# EAGLE schematic Final_schema (EAGLE 8.6.2)
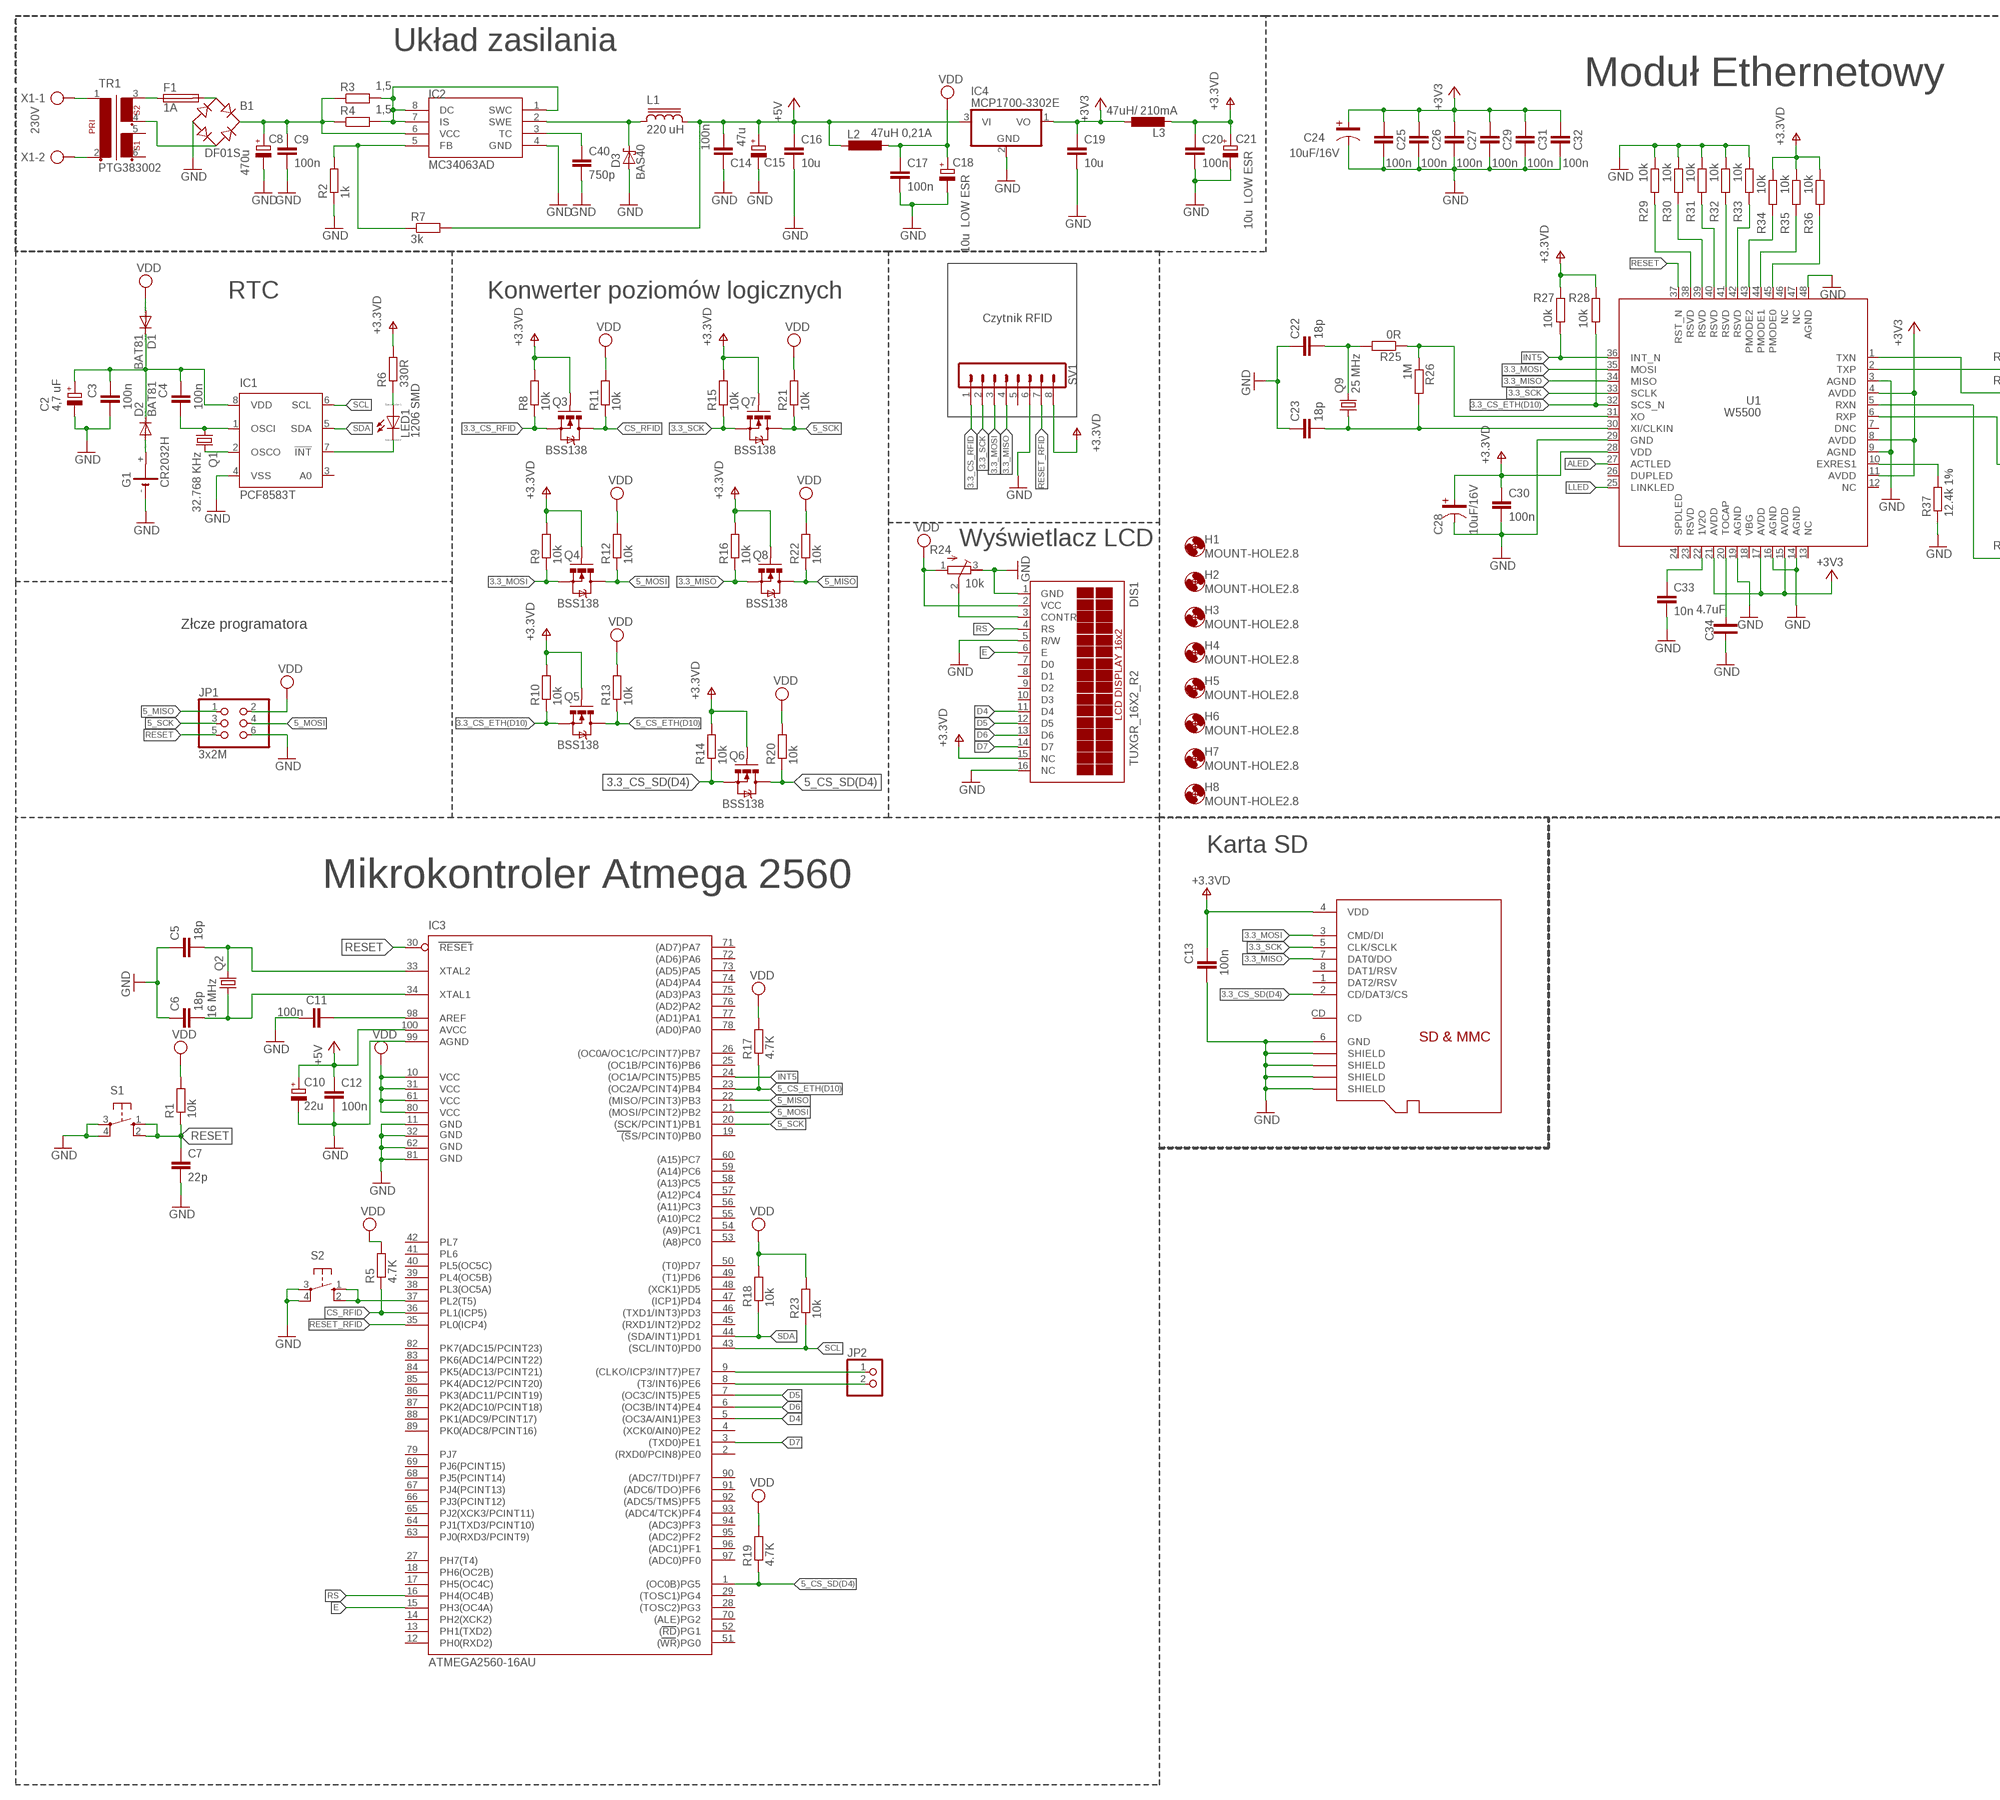
[diagram p0: schematic, sheet 1, part 1 of 2]
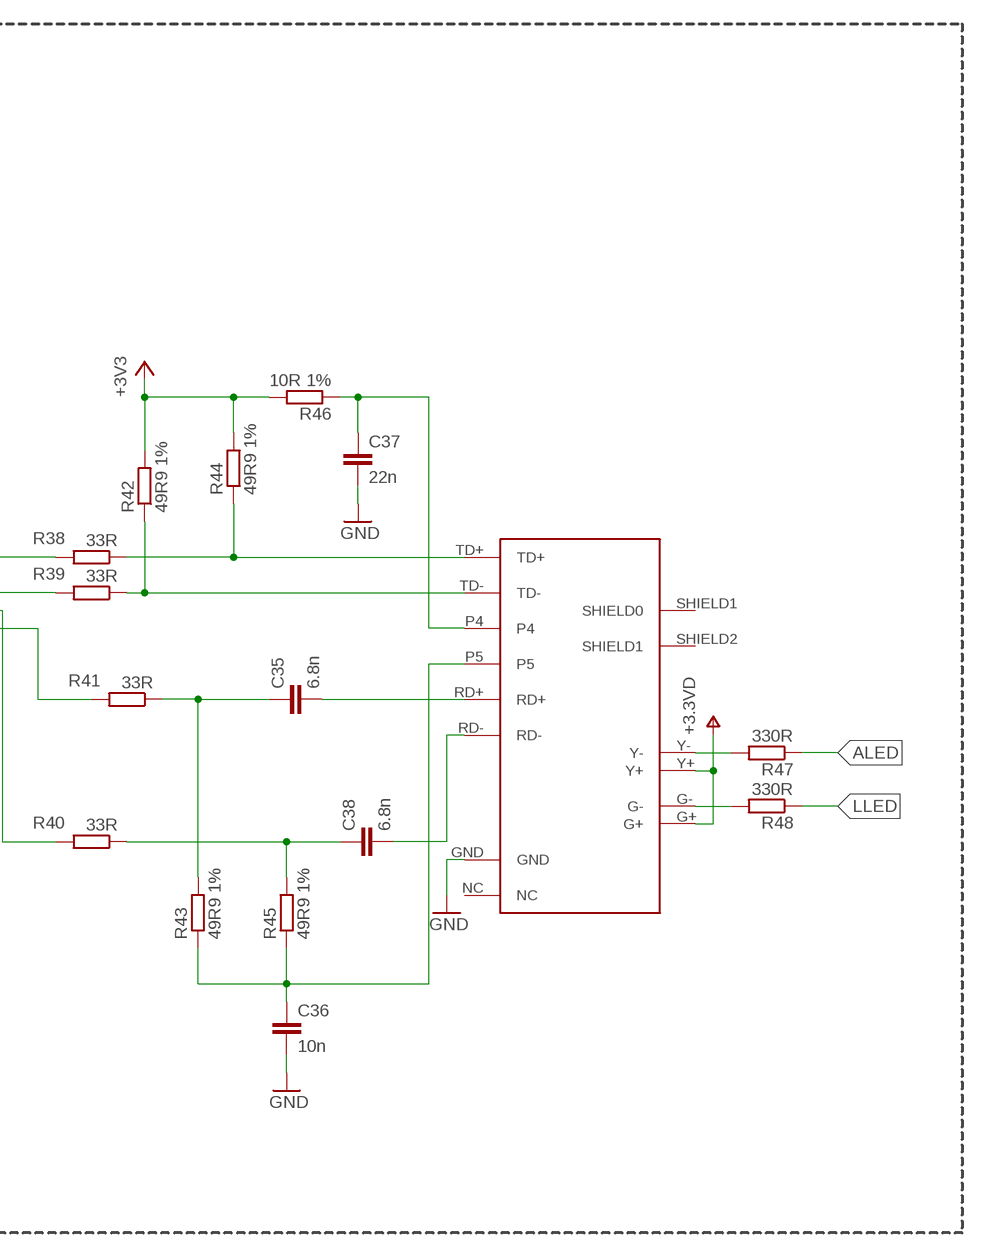
[diagram p1: schematic, sheet 1, part 2 of 2]

## Parts
B1  DF01S  DBDB101G  [DB]
C2  4,7 uF  CPOL-EUUD-5X5,8  [UD-5X5,8_NICHICON]
C3  100n  C-EUC0603  [C0603]
C4  100n  C-EUC0603  [C0603]
C5  18p  C-EUC0603  [C0603]
C6  18p  C-EUC0603  [C0603]
C7  22p  C-EUC0603  [C0603]
C8  470u  CPOL-EUE7.5-16  [E7,5-16]
C9  100n  C-EUC0603  [C0603]
C10  22u  CPOL-EUUD-5X5,8  [UD-5X5,8_NICHICON]
C11  100n  C-EU0603-RND  [C0603-ROUND]
C12  100n  C-EUC0603  [C0603]
C13  100n  C-EUC0603  [C0603]
C14  100n  C-EUC0603  [C0603]
C15  47u  CPOL-EU153CLV-0505  [153CLV-0505]
C16  10u  C-EUC0603  [C0603]
C17  100n  C-EUC0603K  [C0603K]
C18  10u LOW ESR  CPOL-EUE5-10.5  [E5-10,5]
C19  10u  C-EUC0603  [C0603]
C20  100n  C-EUC0603K  [C0603K]
C21  10u LOW ESR  CPOL-EUE5-10.5  [E5-10,5]
C22  18p  C-EUC0603  [C0603]
C23  18p  C-EUC0603  [C0603]
C24  10uF/16V  C-3216(TANTAL)  [C-3216(TANTAL)]
C25  100n  C-EUC0603  [C0603]
C26  100n  C-EUC0603  [C0603]
C27  100n  C-EUC0603  [C0603]
C28  10uF/16V  C-3216(TANTAL)  [C-3216(TANTAL)]
C29  100n  C-EUC0603  [C0603]
C30  100n  C-EUC0603K  [C0603K]
C31  100n  C-EUC0603  [C0603]
C32  100n  C-EUC0603  [C0603]
C33  10n  C-EUC0603  [C0603]
C34  4.7uF  C-2012  [C-2012]
C35  6.8n  C-EUC0603  [C0603]
C36  10n  C-EUC0603  [C0603]
C37  22n  C-EUC0603  [C0603]
C38  6.8n  C-EUC0603  [C0603]
C40  750p  C-EUC0603K  [C0603K]
D1  BAT81  [DO34-7]
D2  BAT81  [DO34-7]
D3  BAS40  [SOT23]
DIS1  TUXGR_16X2_R2  [TUXGR_16X2_R2]
F1  1A  GSH15  [GSH15]
G1  CR2032H  [CR2032H]
H1  MOUNT-HOLE2.8  [2,8]
H2  MOUNT-HOLE2.8  [2,8]
H3  MOUNT-HOLE2.8  [2,8]
H4  MOUNT-HOLE2.8  [2,8]
H5  MOUNT-HOLE2.8  [2,8]
H6  MOUNT-HOLE2.8  [2,8]
H7  MOUNT-HOLE2.8  [2,8]
H8  MOUNT-HOLE2.8  [2,8]
IC1  PCF8583T  [SO8-7_5]
IC2  MC34063AD  [SOIC8]
IC3  ATMEGA2560-16AU  ATMEGA25602560-16AU  [TQFP100]
IC4  MCP1700-3302E  LM340LZ-05  [TO92]
JP1  3x2M  PINHD-2X3  [2X03]
JP2  D5  PINHD-1X2  [1X02]
L1  220 uH  CD54  [CD54]
L2  47uH 0,21A  L-EUL1812  [L1812]
L3  47uH/ 210mA  L-EUL1812  [L1812]
LED1  1206 SMD  LED_E  [LED_1206]
Q1  32.768 KHz  CRYSTALTC26H  [TC26H]
Q2  16 MHz  CRYSTALHC49S  [HC49/S]
Q3  BSS138  MOSFET-NCHANNELSMD  [SOT23-3]
Q4  BSS138  MOSFET-NCHANNELSMD  [SOT23-3]
Q5  BSS138  MOSFET-NCHANNELSMD  [SOT23-3]
Q6  BSS138  MOSFET-NCHANNELSMD  [SOT23-3]
Q7  BSS138  MOSFET-NCHANNELSMD  [SOT23-3]
Q8  BSS138  MOSFET-NCHANNELSMD  [SOT23-3]
Q9  25 MHz  CRYSTALHC49S  [HC49/S]
R1  10k  R-EU_R0603  [R0603]
R2  1k  R-EU_R0603  [R0603]
R3  1,5  R-EU_0411/15  [0411/15]
R4  1,5  R-EU_0411/15  [0411/15]
R5  4.7K  R-EU_R0603  [R0603]
R6  330R  R-EU_R0603  [R0603]
R7  3k  R-EU_R0603  [R0603]
R8  10k  R-EU_R0603  [R0603]
R9  10k  R-EU_R0603  [R0603]
R10  10k  R-EU_R0603  [R0603]
R11  10k  R-EU_R0603  [R0603]
R12  10k  R-EU_R0603  [R0603]
R13  10k  R-EU_R0603  [R0603]
R14  10k  R-EU_R0603  [R0603]
R15  10k  R-EU_R0603  [R0603]
R16  10k  R-EU_R0603  [R0603]
R17  4.7K  R-EU_R0603  [R0603]
R18  10k  R-EU_R0603  [R0603]
R19  4.7K  R-EU_R0603  [R0603]
R20  10k  R-EU_R0603  [R0603]
R21  10k  R-EU_R0603  [R0603]
R22  10k  R-EU_R0603  [R0603]
R23  10k  R-EU_R0603  [R0603]
R24  10k  R-TRIMM4G/J  [RTRIM4G/J]
R25  0R  R-EU_R0603  [R0603]
R26  1M  R-EU_R0603  [R0603]
R27  10k  R-EU_R0603  [R0603]
R28  10k  R-EU_R0603  [R0603]
R29  10k  R-EU_R0603  [R0603]
R30  10k  R-EU_R0603  [R0603]
R31  10k  R-EU_R0603  [R0603]
R32  10k  R-EU_R0603  [R0603]
R33  10k  R-EU_R0603  [R0603]
R34  10k  R-EU_R0603  [R0603]
R35  10k  R-EU_R0603  [R0603]
R36  10k  R-EU_R0603  [R0603]
R37  12.4k 1%  R-EU_R0603  [R0603]
R38  33R  R-EU_R0603  [R0603]
R39  33R  R-EU_R0603  [R0603]
R40  33R  R-EU_R0603  [R0603]
R41  33R  R-EU_R0603  [R0603]
R42  49R9 1%  R-EU_R0603  [R0603]
R43  49R9 1%  R-EU_R0603  [R0603]
R44  49R9 1%  R-EU_R0603  [R0603]
R45  49R9 1%  R-EU_R0603  [R0603]
R46  10R 1%  R-EU_R0603  [R0603]
R47  330R  R-EU_R0603  [R0603]
R48  330R  R-EU_R0603  [R0603]
S1  SW3  10-XX  [B3F-10XX]
S2  SW  10-XX  [B3F-10XX]
SV1  RC522  MA08-1  [MA08-1]
TR1  PTG383002  VR12  [VR12]
U1  W5500  [W5500]
U$1  HR911105A  [RJ45]
U$2  MICROSD  [C12075]
X1  230V  AK500/2-H  [AK500/2-H]

## Nets
3.3_CS_ETH(D10): Q5.2(S) R10.1 R28.1 U1.32(SCS_N)
3.3_CS_RFID: Q3.2(S) R8.1 SV1.1
3.3_CS_SD(D4): Q6.2(S) R14.1 U$2.2(CD/DAT3/CS)
3.3_MISO: Q8.2(S) R16.1 SV1.4 U1.34(MISO) U$2.7(DAT0/DO)
3.3_MOSI: Q4.2(S) R9.1 SV1.3 U1.35(MOSI) U$2.3(CMD/DI)
3.3_SCK: Q7.2(S) R15.1 SV1.2 U1.33(SCLK) U$2.5(CLK/SCLK)
5_CS_ETH(D10): IC3.23((OC2A/PCINT4)PB4) Q5.3(D) R13.1 R17.1
5_CS_SD(D4): IC3.1((OC0B)PG5) Q6.3(D) R19.1 R20.1
5_MISO: IC3.22((MISO/PCINT3)PB3) JP1.1 Q8.3(D) R22.1
5_MOSI: IC3.21((MOSI/PCINT2)PB2) JP1.4 Q4.3(D) R12.1
5_SCK: IC3.20((SCK/PCINT1)PB1) JP1.3 Q7.3(D) R21.1
+3V3: C19.1 C24.1 C25.1 C26.1 C27.1 C29.1 C31.1 C32.1 IC4.1(VO) L3.1 R42.2 R44.2 R46.2 U1.4(AVDD) U1.8(AVDD) U1.11(AVDD) U1.15(AVDD) U1.17(AVDD) U1.21(AVDD)
+5V: C10.+ C12.1 C14.1 C15.+ C16.1 IC3.100(AVCC) IC4.3(VI) L1.2 L2.2 R7.2
ALED: R47.1 U1.27(ACTLED)
AREF: C11.1 IC3.98(AREF)
CS_RFID: IC3.36(PL1(ICP5)) Q3.3(D) R5.1 R11.1
D4: DIS1.11(D4) IC3.5((OC3A/AIN1)PE3)
D5: DIS1.12(D5) IC3.7((OC3C/INT5)PE5)
D6: DIS1.13(D6) IC3.6((OC3B/INT4)PE4)
D7: DIS1.14(D7) IC3.3((TXD0)PE1)
E: DIS1.6(E) IC3.15(PH3(OC4A))
GND: B1.- C2.- C3.2 C5.1 C6.1 C7.2 C8.- C9.2 C10.- C11.2 C12.2 C13.2 C14.2 C15.- C16.2 C17.2 C18.- C19.2 C20.2 C21.- C22.1 C23.1 C24.2 C25.2 C26.2 C27.2 C28.2 C29.2 C30.2 C31.2 C32.2 C33.2 C34.P$1 C36.2 C37.2 C40.2 D3.1(A) DIS1.1(GND) DIS1.5(R/W) DIS1.16(NC) G1.- IC1.4(VSS) IC2.4(GND) IC3.11(GND) IC3.32(GND1) IC3.62(GND2) IC3.81(GND3) IC3.99(AGND) IC4.2(GND) JP1.6 R2.1 R24.3(E) R29.2 R30.2 R31.2 R32.2 R33.2 R37.1 S1.3(P) S1.4(P1) S2.3(P) S2.4(P1) SV1.6 U1.3(AGND) U1.9(AGND) U1.14(AGND) U1.16(AGND) U1.19(AGND) U1.29(GND) U1.48(AGND) U$1.GND U$2.6(GND) U$2.GND@1(SHIELD) U$2.GND@2(SHIELD) U$2.GND@3(SHIELD) U$2.GND@4(SHIELD)
INT5: IC3.24((OC1A/PCINT5)PB5) R27.1 U1.36(INT_N)
LLED: R48.1 U1.25(LINKLED)
N$1: IC1.7(!INT) LED1.C
N$2: R29.1 U1.38(RSVD)
N$3: IC2.5(FB) R2.2 R7.1
N$4: IC2.1(SWC) IC2.7(IS) IC2.8(DC) R3.2 R4.2
N$5: D3.3(C) IC2.2(SWE) L1.1
N$6: C40.1 IC2.3(TC)
N$7: TR1.1 X1.1
N$8: TR1.2 X1.2
N$9: B1.AC1 F1.2
N$10: B1.AC2 TR1.4
N$11: F1.1 TR1.3
N$12: B1.+ C8.+ C9.1 IC2.6(VCC) R3.1 R4.1
N$13: R47.2 U$1.Y-
N$14: R41.2 U1.6(RXP)
N$15: DIS1.3(CONTR) R24.2(S)
N$16: R30.1 U1.39(RSVD)
N$17: R31.1 U1.40(RSVD)
N$18: C22.2 Q9.2 R25.2
N$19: IC3.9((CLKO/ICP3/INT7)PE7) JP2.1
N$20: IC3.8((T3/INT6)PE6) JP2.2
N$21: R48.2 U$1.G-
N$26: IC3.37(PL2(T5)) S2.1(S) S2.2(S1)
N$27: C4.2 IC1.1(OSCI) Q1.1
N$28: IC1.2(OSCO) Q1.2
N$29: D2.A G1.+
N$31: C2.+ C3.1 C4.1 D1.C D2.C IC1.8(VDD)
N$41: R32.1 U1.41(RSVD)
N$42: R33.1 U1.42(RSVD)
N$43: R34.1 U1.43(PMODE2)
N$44: R35.1 U1.44(PMODE1)
N$45: R36.1 U1.45(PMODE0)
N$46: C34.P$2 U1.20(TOCAP)
N$47: C33.1 U1.22(1V2O)
N$48: R37.2 U1.10(EXRES1)
N$49: C37.1 R46.1 U$1.P4
N$50: C35.2 U$1.RD+
N$51: C38.2 U$1.RD-
N$52: C36.1 R43.1 R45.1 U$1.P5
N$54: LED1.A R6.1
N$58: R25.1 R26.1 U1.31(XO)
N$60: R40.2 U1.5(RXN)
N$61: R38.2 U1.2(TXP)
N$62: R39.2 U1.1(TXN)
N$63: C23.2 Q9.1 R26.2 U1.30(XI/CLKIN)
RESET: C7.1 IC3.30(RESET) JP1.5 R1.1 S1.1(S) S1.2(S1) U1.37(RST_N)
RESET_RFID: IC3.35(PL0(ICP4)) SV1.7
RS: DIS1.4(RS) IC3.16(PH4(OC4B))
RXN: C38.1 R40.1 R45.2
RXP: C35.1 R41.1 R43.2
SCL: IC1.6(SCL) IC3.43((SCL/INT0)PD0) R23.1
SDA: IC1.5(SDA) IC3.44((SDA/INT1)PD1) R18.1
TXN: R39.1 R42.1 U$1.TD-
TXP: R38.1 R44.1 U$1.TD+
V+: C13.1 C20.1 C21.+ C28.1 C30.1 DIS1.15(NC) L3.2 Q3.1(G) Q4.1(G) Q5.1(G) Q6.1(G) Q7.1(G) Q8.1(G) R6.2 R8.2 R9.2 R10.2 R14.2 R15.2 R16.2 R27.2 R28.2 R34.2 R35.2 R36.2 SV1.8 U1.28(VDD) U$1.G+ U$1.Y+ U$2.4(VDD) ; supply symbol labelled +3.3VD
VDD: C17.1 C18.+ D1.A DIS1.2(VCC) IC3.10(VCC) IC3.31(VCC1) IC3.61(VCC2) IC3.80(VCC3) JP1.2 L2.1 R1.2 R5.2 R11.2 R12.2 R13.2 R17.2 R18.2 R19.2 R20.2 R21.2 R22.2 R23.2 R24.1(A)
XTAL1: C6.2 IC3.34(XTAL1) Q2.1
XTAL2: C5.2 IC3.33(XTAL2) Q2.2
Unconnected: DIS1.7(D0) DIS1.8(D1) DIS1.9(D2) DIS1.10(D3) G1.+@1(+) IC1.3(A0) IC3.2((RXD0/PCIN8)PE0) IC3.4((XCK0/AIN0)PE2) IC3.12(PH0(RXD2)) IC3.13(PH1(TXD2)) IC3.14(PH2(XCK2)) IC3.17(PH5(OC4C)) IC3.18(PH6(OC2B)) IC3.19((SS/PCINT0)PB0) IC3.25((OC1B/PCINT6)PB6) IC3.26((OC0A/OC1C/PCINT7)PB7) IC3.27(PH7(T4)) IC3.28((TOSC2)PG3) IC3.29((TOSC1)PG4) IC3.38(PL3(OC5A)) IC3.39(PL4(OC5B)) IC3.40(PL5(OC5C)) IC3.41(PL6) IC3.42(PL7) IC3.45((RXD1/INT2)PD2) IC3.46((TXD1/INT3)PD3) IC3.47((ICP1)PD4) IC3.48((XCK1)PD5) IC3.49((T1)PD6) IC3.50((T0)PD7) IC3.51((WR)PG0) IC3.52((RD)PG1) IC3.53((A8)PC0) IC3.54((A9)PC1) IC3.55((A10)PC2) IC3.56((A11)PC3) IC3.57((A12)PC4) IC3.58((A13)PC5) IC3.59((A14)PC6) IC3.60((A15)PC7) IC3.63(PJ0(RXD3/PCINT9)) IC3.64(PJ1(TXD3/PCINT10)) IC3.65(PJ2(XCK3/PCINT11)) IC3.66(PJ3(PCINT12)) IC3.67(PJ4(PCINT13)) IC3.68(PJ5(PCINT14)) IC3.69(PJ6(PCINT15)) IC3.70((ALE)PG2) IC3.71((AD7)PA7) IC3.72((AD6)PA6) IC3.73((AD5)PA5) IC3.74((AD4)PA4) IC3.75((AD3)PA3) IC3.76((AD2)PA2) IC3.77((AD1)PA1) IC3.78((AD0)PA0) IC3.79(PJ7) IC3.82(PK7(ADC15/PCINT23)) IC3.83(PK6(ADC14/PCINT22)) IC3.84(PK5(ADC13/PCINT21)) IC3.85(PK4(ADC12/PCINT20)) IC3.86(PK3(ADC11/PCINT19)) IC3.87(PK2(ADC10/PCINT18)) IC3.88(PK1(ADC9/PCINT17)) IC3.89(PK0(ADC8/PCINT16)) IC3.90((ADC7/TDI)PF7) IC3.91((ADC6/TDO)PF6) IC3.92((ADC5/TMS)PF5) IC3.93((ADC4/TCK)PF4) IC3.94((ADC3)PF3) IC3.95((ADC2)PF2) IC3.96((ADC1)PF1) IC3.97((ADC0)PF0) SV1.5 TR1.5 TR1.6 U1.7(DNC) U1.12(NC) U1.13(NC) U1.18(VBG) U1.23(RSVD) U1.24(SPDLED) U1.26(DUPLED) U1.46(NC) U1.47(NC) U$1.NC U$1.SHIELD1(SHIELD0) U$1.SHIELD2(SHIELD1) U$2.1(DAT2/RSV) U$2.8(DAT1/RSV) U$2.CD

## Notes on the sheet
- Układ zasilania
- Moduł Ethernetowy
- 230V
- RTC | Konwerter poziomów logicznych
- Czytnik RFID
- Wyświetlacz LCD
- Złcze programatora
- Karta SD
- Mikrokontroler Atmega 2560

## Library data of the parts
B1 = rectifier:DB?*G: Single Phase 1.0 AMP Glass Passivated Bridge Rectifier Taiwan Semiconductor Co.,Ltd. - TSC Source: http://www.taiwansemi.com/TSCbig5/ezcatfiles/cust/img/img/db101g.pdf http://www.ts.com.tw/db/pictures/modules/PDT/PDT060207001/DBLS201G.pdf
C2 C8 C10 C15 C18 C21 = rcl:CPOL-EU: POLARIZED CAPACITOR, European symbol; SPICEPREFIX: C
C3-C7 C9 C12-C14 C16 C17 C19 C20 C22 C23 C25-C27 C29-C33 C35-C38 C40 = rcl:C-EU: CAPACITOR, European symbol; SPICEPREFIX: C
C11 = SmartPrj:C-EU: CAPACITOR, European symbol
C24 C28 = CAP:C-3216(TANTAL); SPICEPREFIX: C
C34 = CAP:C-2012
D1 D2 = diode:BAT81: DIODE barrier diode
D3 = diode:BAS40: Silicon Schottky Diodes General-purpose diode for high-speed switching
DIS1 = display-lcd:TUXGR_16X2_R2: Tuxgraphics LCD display 16x2 characters reflective, without background light Source: tuxgr_12x2_r2.pdf; OC_FARNELL: unknown; OC_NEWARK: unknown; SPICEPREFIX: X
F1 = fuse:GSH15: FUSE HOLDER grid 15mm, 19649 Wickmann; MPN: 64900001039; OC_FARNELL: 1271673; OC_NEWARK: 02P0318
G1 = battery:CR2032H: LI BATTERY Varta
H1-H8 = holes:MOUNT-HOLE: MOUNTING HOLE with drill center marker
IC1 = ds1307_pcf8583:PCF8583: I2C-Bus CLOCK/CALENDAR
IC2 = mc34063:MC34063
IC3 = SmartPrj:ATMEGA2560: MICROCONTROLLER 64/128/256 Kbytes FLASH 4 Kbytes EEPROM 8 Kbytes SRAM 86 General Purpose I/O pins 12-channels16-bit PWM 4 x Serial USARTs 16-channels 10-bit A/D
IC4 = linear:LM340?-*: Positive VOLTAGE REGULATOR Source: http://cache.national.com/ds/LM/LM340.pdf
JP1 = SmartPrj:PINHD-2X3: PIN HEADER
JP2 = pinhead:PINHD-1X2: PIN HEADER
L1 = inductor-sumida:CD54: POWER INDUCTOR
L2 L3 = rcl:L-EU: INDUCTOR, European symbol; SPICEPREFIX: L
LED1 = eagle-ltspice:LED_E: LED Source: http://www.osram.convergy.de Source: www.luxeon.com Source: www.kingbright.com; SPICEMODEL: NONE; SPICEPREFIX: D; SPICETYPE: diode
Q1 = crystal:CRYSTAL: CRYSTAL; OC_FARNELL: unknown; OC_NEWARK: unknown
Q2 Q9 = crystal:CRYSTAL: CRYSTAL; OC_FARNELL: 1667008; OC_NEWARK: unknown
Q3-Q8 = SparkFun:MOSFET-NCHANNEL
R1-R23 R25-R48 = rcl:R-EU_: RESISTOR, European symbol; SPICEPREFIX: R
R24 = resistor:R-TRIMM: Trimm resistor
S1 S2 = switch-omron:10-XX: OMRON SWITCH; MPN: B3F-1000; OC_FARNELL: 176432; OC_NEWARK: 36M3542
SV1 = con-lstb:MA08-1: PIN HEADER; OC_FARNELL: unknown; OC_NEWARK: unknown
TR1 = trafo_inżynierka:VR12: TRANSFORMER 1 primary winding, 2 secondary windings BLOCK; SPICEPREFIX: X
U1 = W5500:W5500
U$1 = HR911105A:HR911105A
U$2 = micro-sd:MICROSD: Micro-SD / Transflash card holder with SPI pinout For the 3M # 2908-05WB-MG and/or 4UCON #19656 push-push type
X1 = con-ptr500:AK500/2-H: CONNECTOR Aug. 2004 / PTR Meßtechnik: Die Bezeichnung der Serie AK505 wurde geändert. Es handelt sich hierbei um AK500 in horizontaler Ausführung.; OC_FARNELL: unknown; OC_NEWARK: unknown

## Net classes
1 power: width 0.152 mm, drill 0.61 mm, clearance 0.152 mm
2 gnd: width 0.305 mm, drill 0.406 mm, clearance 0.203 mm
3 power usb: width 0.508 mm, drill 0.406 mm, clearance 0.203 mm